# Altium schematic sheet 06_SENSORS.SchDoc
size A
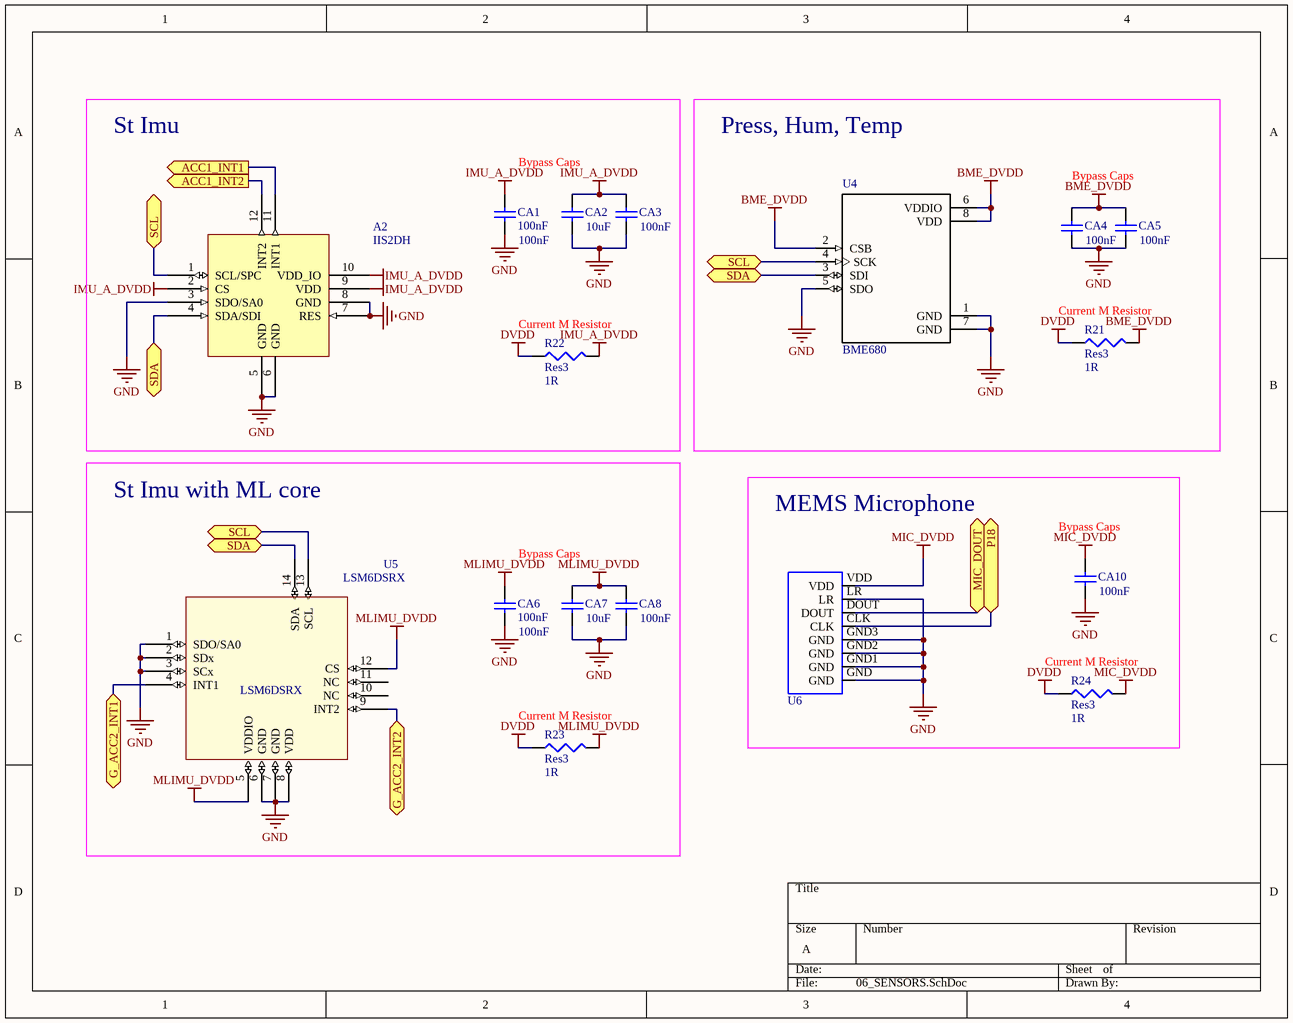
[diagram p0: 06_SENSORS.SchDoc]

## Parts
A2  IIS2DH  [*LGA12R50P4X4_200X200X86]
CA1  100nF  [0402]
CA2  10uF  [0402]
CA3  100nF  [0402]
CA4  100nF  [0402]
CA5  100nF  [0402]
CA6  100nF  [0402]
CA7  10uF  [0402]
CA8  100nF  [0402]
CA10  100nF  [0402]
R21  Res3  value 1R  [0402]
R22  Res3  value 1R  [0402]
R23  Res3  value 1R  [0402]
R24  Res3  value 1R  [0402]
U4  BME680  [*PSON80P300X300X100-8N]
U5  LSM6DSRX  [*PQFN50P300X250X86-14N]
U6  MP34DT05-A  [MIC-PACK_MP34DT05-A(Primary)]  (value not drawn)

## Blocks framed on the sheet
St Imu: A2 CA1-CA3 R22
Press, Hum, Temp: CA4 CA5 R21 U4
St Imu with ML core: CA6-CA8 R23 U5
MEMS Microphone: CA10 R24 U6

## Ports
ACC1_INT1 (out), ACC1_INT2 (out), G_ACC2_INT1 (bidir), G_ACC2_INT2 (bidir), MIC_DOUT (bidir), P18, SCL, SDA

## Nets
BME_DVDD: CA4.2 CA5.2 R21.2 U4.2(CSB) U4.6(VDDIO) U4.8(VDD)
DVDD: R21.1 R22.1 R23.1 R24.1
GND: A2.3(SDO/SA0) A2.5(GND) A2.6(GND) A2.7(RES) A2.8(GND) CA1.1 CA2.1 CA3.1 CA4.1 CA5.1 CA6.1 CA7.1 CA8.1 CA10.1 U4.1(GND) U4.5(SDO) U4.7(GND) U5.1(SDO/SA0) U5.2(SDx) U5.3(SCx) U5.6(GND) U5.7(GND) U5.8(VDD) U6.GND U6.GND1(GND) U6.GND2(GND) U6.GND3(GND) U6.LR
IMU_A_DVDD: A2.2(CS) A2.9(VDD) A2.10(VDD_IO) CA1.2 CA2.2 CA3.2 R22.2
MIC_DVDD: CA10.2 R24.2 U6.VDD
MLIMU_DVDD: CA6.2 CA7.2 CA8.2 R23.2 U5.5(VDDIO) U5.12(CS)
ACC1_INT1: A2.11(INT1) ; port ACC1_INT1
ACC1_INT2: A2.12(INT2) ; port ACC1_INT2
G_ACC2_INT1: U5.4(INT1) ; port G_ACC2_INT1
G_ACC2_INT2: U5.9(INT2) ; port G_ACC2_INT2
MIC_DOUT: U6.DOUT ; port MIC_DOUT
P18: U6.CLK ; port P18
SCL: A2.1(SCL/SPC) U4.4(SCK) U5.13(SCL) ; port SCL
SDA: A2.4(SDA/SDI) U4.3(SDI) U5.14(SDA) ; port SDA

Not connected (* = marked no-connect by the designer): U5 10(NC) 11(NC)

## Notes on the sheet
- Bypass Caps
- (near R22) Current M Resistor
- (near R21) Current M Resistor
- (near CA10) Bypass Caps
- (near R24) Current M Resistor
- (near R23) Current M Resistor

## Library data of the parts
CA1-CA8 CA10 = Cap Semi: Capacitor (Semiconductor SIM Model); Published: 8-Jun-2000; LatestRevisionDate: 29-May-2009; LatestRevisionNote: IPC-7351 Footprint Added.; PackageReference: C1206; Publisher: Altium Limited; PackageDescription: Chip Capacitor
  CA1 CA3-CA6 CA8 CA10: Value: 100nF
  CA2 CA7: Value: 10uF
R21-R24 = Res3: Resistor; Published: 8-Jun-2000; LatestRevisionDate: 29-May-2009; LatestRevisionNote: IPC-7351 Footprint Added.; PackageReference: J1-0603; Publisher: Altium Limited; PackageDescription: Chip Resistor
U4 = BME680: Integrated Environmental Unit; MF: Bosch Sensortec; SnapEDA_Link: https://www.snapeda.com/parts/BME680/Bosch%20Sensortec/view-part/?ref=snap; MP: BME680; Availability: Unavailable; Price: None; Package: LGA-8 Bosch Tools; Value: *
U6 = MP34DT05-A: Mic Omni-Directional -26dB 3.6Vdc Rectangular Solder Pad; MF: STMicroelectronics; MP: MP34DT05-A; Package: None; Availability: Unavailable; SnapEDA_Link: https://www.snapeda.com/parts/MP34DT05-A/STMicroelectronics/view-part/?ref=snap; Price: None; Value: *